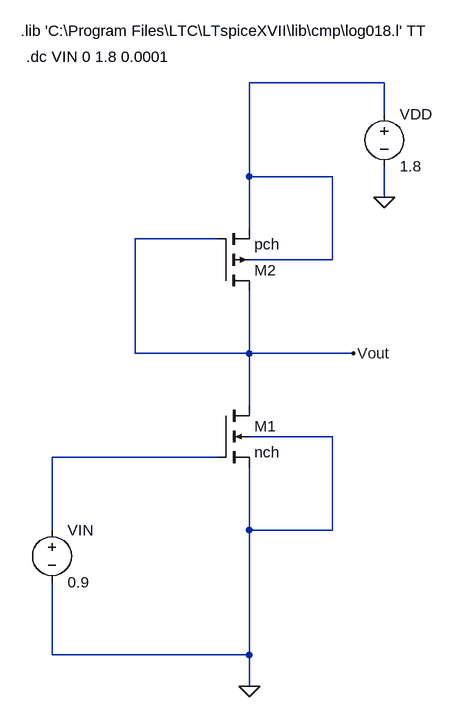
[diagram p0: schematic cir1.asc]
cir1.asc, the LTspice schematic file:
Version 4
SHEET 1 880 1060
WIRE 416 112 208 112
WIRE 416 160 416 112
WIRE 208 256 208 112
WIRE 336 256 208 256
WIRE 416 288 416 240
WIRE 208 336 208 256
WIRE 160 352 32 352
WIRE 336 384 336 256
WIRE 336 384 208 384
WIRE 32 528 32 352
WIRE 208 528 208 432
WIRE 208 528 32 528
WIRE 368 528 208 528
WIRE 208 608 208 528
WIRE 336 656 208 656
WIRE 160 688 -96 688
WIRE -96 800 -96 688
WIRE 208 800 208 704
WIRE 336 800 336 656
WIRE 336 800 208 800
WIRE -96 992 -96 880
WIRE 208 992 208 800
WIRE 208 992 -96 992
WIRE 208 1040 208 992
FLAG 416 288 0
FLAG 368 528 Vout
FLAG 208 1040 0
SYMBOL nmos4 160 608 R0
SYMATTR InstName M1
SYMATTR Value nch
SYMATTR Value2 l=1u w=3u
SYMBOL pmos4 160 432 M180
SYMATTR InstName M2
SYMATTR Value pch
SYMATTR Value2 l=1u w=15u
SYMBOL voltage 416 144 R0
WINDOW 123 0 0 Left 0
WINDOW 39 0 0 Left 0
SYMATTR InstName VDD
SYMATTR Value 1.8
SYMBOL voltage -96 784 R0
WINDOW 123 0 0 Left 0
WINDOW 39 0 0 Left 0
SYMATTR InstName VIN
SYMATTR Value 0.9
TEXT -144 32 Left 2 !.lib 'C:\\Program Files\\LTC\\LTspiceXVII\\lib\\cmp\\log018.l' TT
TEXT -136 72 Left 2 !.dc VIN 0 1.8 0.0001

The netlist it stands for:
* cir1.asc
M1 Vout N002 0 0 nch l=1u w=3u
M2 Vout Vout N001 N001 pch l=1u w=15u
VDD N001 0 1.8
VIN N002 0 0.9
.model NMOS NMOS
.model PMOS PMOS
.lib standard.mos
.lib 'C:\Program Files\LTC\LTspiceXVII\lib\cmp\log018.l' TT
.dc VIN 0 1.8 0.0001
.backanno
.end

* Results of the author's LTspice run, read from the files saved beside the schematic
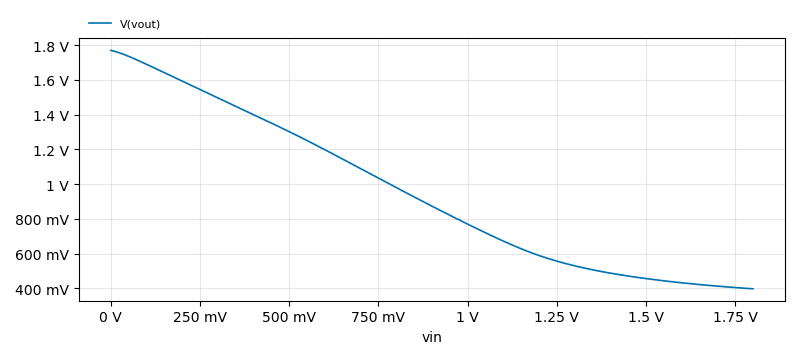
[diagram p1: DC transfer characteristic of cir1.asc, plotted from the saved traces]
* DC transfer characteristic, 1 run:
*   V(vout): 1.771 V at vin=0 V, 397 mV at vin=1.8 V, min 397 mV, max 1.771 V